# Altium schematic sheet 07 USB.SchDoc
size 513 x 386 mm
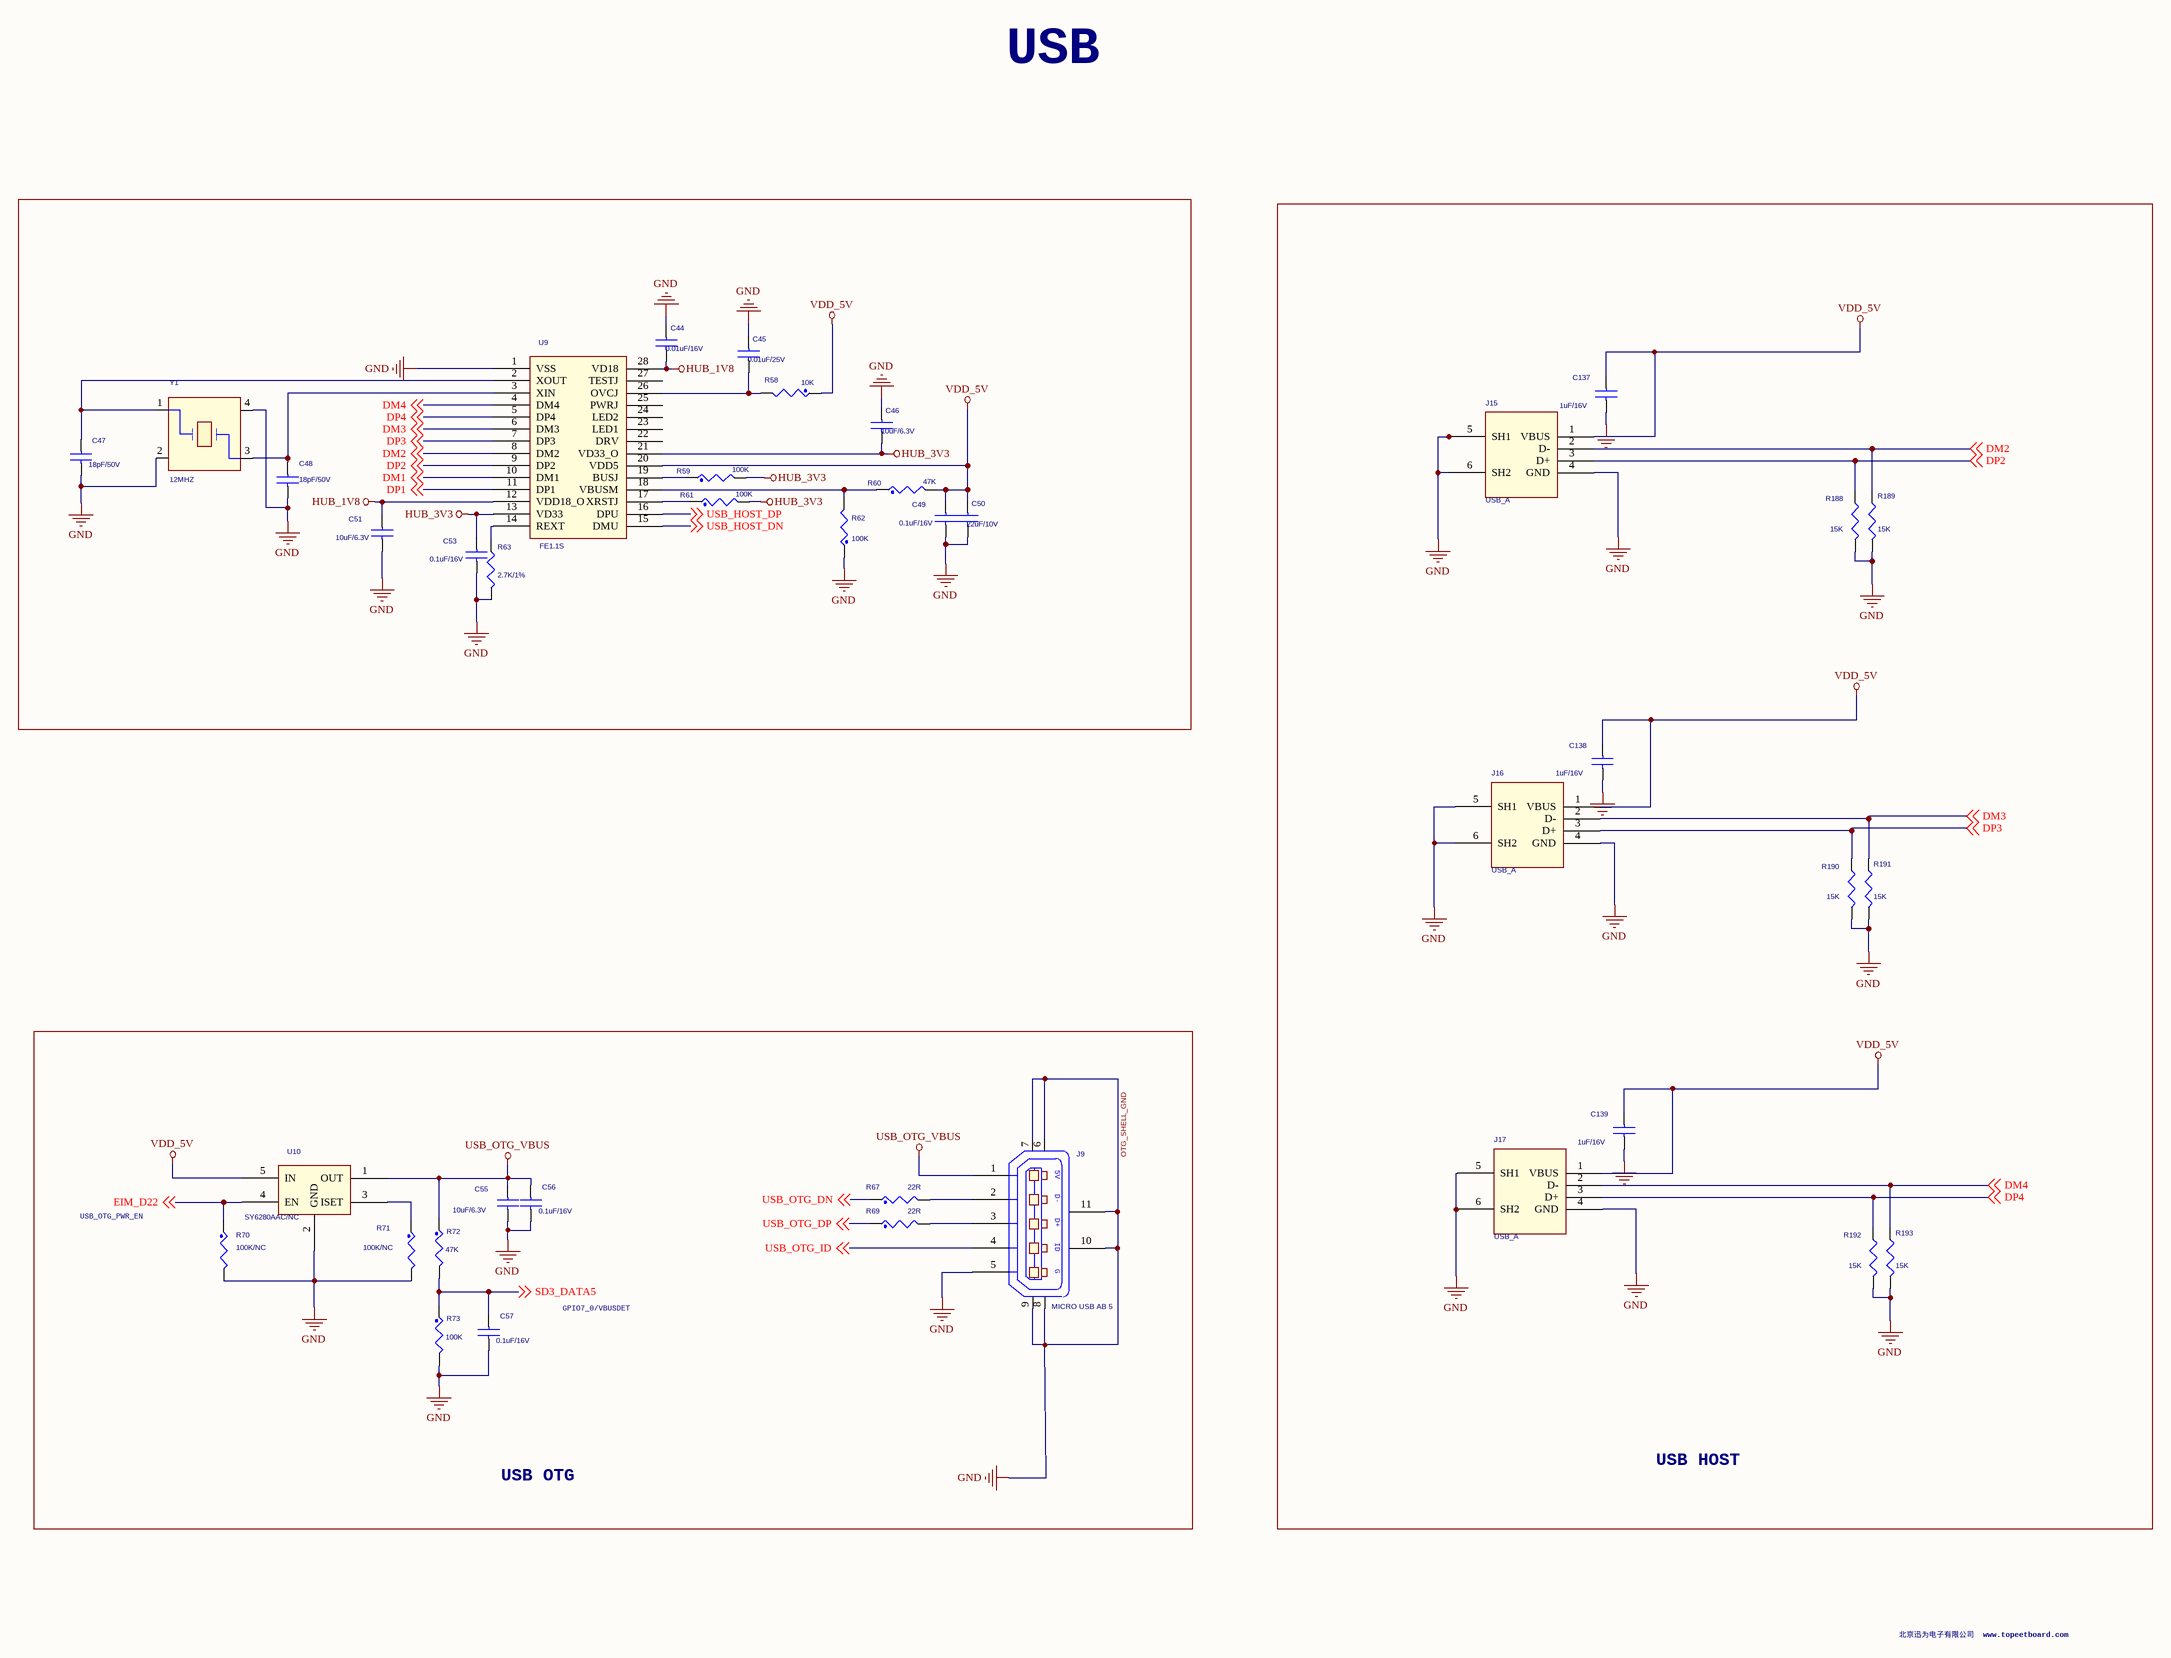
[diagram p0: 07 USB.SchDoc]

## Parts
C44  0.01uF/16V  [C0603]
C45  0.01uF/25V  [C0603]
C46  10uF/6.3V  [C0603]
C47  18pF/50V  [C0603]
C48  18pF/50V  [C0603]
C49  0.1uF/16V  [C0603]
C50  22uF/10V  [C0603]
C51  10uF/6.3V  [C0603]
C53  0.1uF/16V  [C0603]
C55  10uF/6.3V  [C0603]
C56  0.1uF/16V  [C0603]
C57  0.1uF/16V  [C0603]
C137  1uF/16V  [C0603]
C138  1uF/16V  [C0603]
C139  1uF/16V  [C0603]
J9  MICRO USB AB 5  [MICROUSB-B-H4-2]
J15  USB_A  [USB-A2]
J16  USB_A  [USB-A2]
J17  USB_A  [USB-A2]
R58  10K  [R0402]
R59  100K  [R0402]
R60  47K  [R0402]
R61  100K  [R0402]
R62  100K  [R0402]
R63  2.7K/1%  [R1005]
R67  22R  [R0402]
R69  22R  [R0402]
R70  100K/NC  [R0402]
R71  100K/NC  [R0402]
R72  47K  [R0402]
R73  100K  [R0402]
R188  15K  [R1005]
R189  15K  [R1005]
R190  15K  [R1005]
R191  15K  [R1005]
R192  15K  [R1005]
R193  15K  [R1005]
U9  FE1.1S  [ssop_28_FE1_1S]
U10  SY6280AAC/NC  [sot23_5_SY6280]
Y1  12MHZ  [X4-2_5X3_2]

## Blocks framed on the sheet
USB HOST: C137-C139 J15-J17 R188-R193
USB OTG: C55-C57 J9 R67 R69-R73 U10

## Nets
HUB_1V8: C44.2 C51.1 U9.12(VDD18_O) U9.28(VD18)
HUB_3V3: C46.2 C53.1 R59.2 R61.2 U9.13(VD33) U9.21(VD33_O)
OTG_SHELL_GND: C44.1 C45.1 C46.1 C47.2 C48.2 C49.2 C50.2 C51.2 C53.2 C55.2 C56.2 C57.2 C137.2 C138.2 C139.2 J9.5(P5) J9.6(SHLD1) J9.7(SHLD3) J9.8(SHLD2) J9.9(SHLD4) J9.10(SHLD5) J9.11(SHLD6) J15.4(GND) J15.5(SH1) J15.6(SH2) J16.4(GND) J16.5(SH1) J16.6(SH2) J17.4(GND) J17.5(SH1) J17.6(SH2) R62.1 R63.1 R70.2 R71.2 R73.2 R188.1 R189.1 R190.1 R191.1 R192.1 R193.1 U9.1(VSS) U10.2(GND) Y1.2 Y1.4  [also labelled GND]
USB_OTG_VBUS: C55.1 C56.1 J9.1(P1) R72.1 U10.1(OUT)
VDD_5V: C49.1 C50.1 C137.1 C138.1 C139.1 J15.1(VBUS) J16.1(VBUS) J17.1(VBUS) R58.1 R60.2 U9.20(VDD5) U10.5(IN)
DM1: U9.10(DM1) ; off-sheet DM1
DM2: J15.2(D-) R189.2 U9.8(DM2) ; off-sheet DM2
DM3: J16.2(D-) R191.2 U9.6(DM3) ; off-sheet DM3
DM4: J17.2(D-) R193.2 U9.4(DM4) ; off-sheet DM4
DP1: U9.11(DP1) ; off-sheet DP1
DP2: J15.3(D+) R188.2 U9.9(DP2) ; off-sheet DP2
DP3: J16.3(D+) R190.2 U9.7(DP3) ; off-sheet DP3
DP4: J17.3(D+) R192.2 U9.5(DP4) ; off-sheet DP4
EIM_D22: R70.1 U10.4(EN) ; off-sheet EIM_D22
SD3_DATA5: C57.1 R72.2 R73.1 ; off-sheet SD3_DATA5
USB_HOST_DN: U9.15(DMU) ; off-sheet USB_HOST_DN
USB_HOST_DP: U9.16(DPU) ; off-sheet USB_HOST_DP
USB_OTG_DN: R67.1 ; off-sheet USB_OTG_DN
USB_OTG_DP: R69.1 ; off-sheet USB_OTG_DP
USB_OTG_ID: J9.4(P4) ; off-sheet USB_OTG_ID
NetC45_2: C45.2 R58.2 U9.26(OVCJ)
NetC47_1: C47.1 U9.2(XOUT) Y1.1
NetC48_1: C48.1 U9.3(XIN) Y1.3
NetJ9_2: J9.2(P2) R67.2
NetJ9_3: J9.3(P3) R69.2
NetR59_1: R59.1 U9.19(BUSJ)
NetR60_1: R60.1 R62.2 U9.18(VBUSM)
NetR61_1: R61.1 U9.17(XRSTJ)
NetR63_2: R63.2 U9.14(REXT)
NetR71_1: R71.1 U10.3(ISET)

Not connected (* = marked no-connect by the designer): U9 22(DRV) 23(LED1) 24(LED2) 25(PWRJ) 27(TESTJ)

## Notes on the sheet
- USB
- USB_OTG_PWR_EN
- GPIO7_0/VBUSDET
- 北京迅为电子有限公司  www.topeetboard.com
- (in symbol USB_MINI_AB_RECEPTACLE_1) 5V; D-; D+; ID; G

## Library data of the parts
C44-C51 C53 C55-C57 C137-C139 = C0603_0_Dup1
J9 = USB_MINI_AB_RECEPTACLE_1: CON 1X5 USB_MICRO_AB_RECEPTACLE RA SMT 0.65MM SP 105H AU; AGILE_PN: 211-78722; MFG_NAME01: Molex; MFG_PN01: 47589-0001; CAD_APPROVED: Yes; FPLIST: con5_microusb,con5_microusb_cust; ROHS: Yes; HEIGHT: 2.65MM
J15-J17 = USB
R58-R62 R67 R69 R71 R72 = RES_Dup1: RES MF 10.0K 1/16W 1% AEC-Q200 0402; FPLIST: RC0402_25,RC0402_HD,0402_CC; CAD_APPROVED: Yes; MFG_PN01: RK73H1ETTP1002F; MFG_NAME01: KOA SPEER; AGILE_PN: 470-75416; SIGNAL_MODEL: DEFAULT_RESISTOR_10000OHM_2_1; ROHS: Yes; Tolerance: 1%
R63 R188-R193 = R1005_0_Dup1
R70 R73 = RES_Dup1: RES MF 10.0K 1/16W 1% AEC-Q200 0402; SIGNAL_MODEL: DEFAULT_RESISTOR_10000OHM_2_1; AGILE_PN: 470-75416; MFG_NAME01: KOA SPEER; MFG_PN01: RK73H1ETTP1002F; CAD_APPROVED: Yes; FPLIST: RC0402_25,RC0402_HD,0402_CC; Tolerance: 1%; ROHS: Yes
U10 = SY6280AAC
Y1 = XTAL_13Y: XTAL 25MHZ -- -- SMT; AGILE_PN: 230-77853; MFG_NAME01: ABRACON CORP; MFG_PN01: ABMM-25.000MHZ-B2-T; CAD_APPROVED: Yes; ROHS: Yes; HEIGHT: 1.3MM